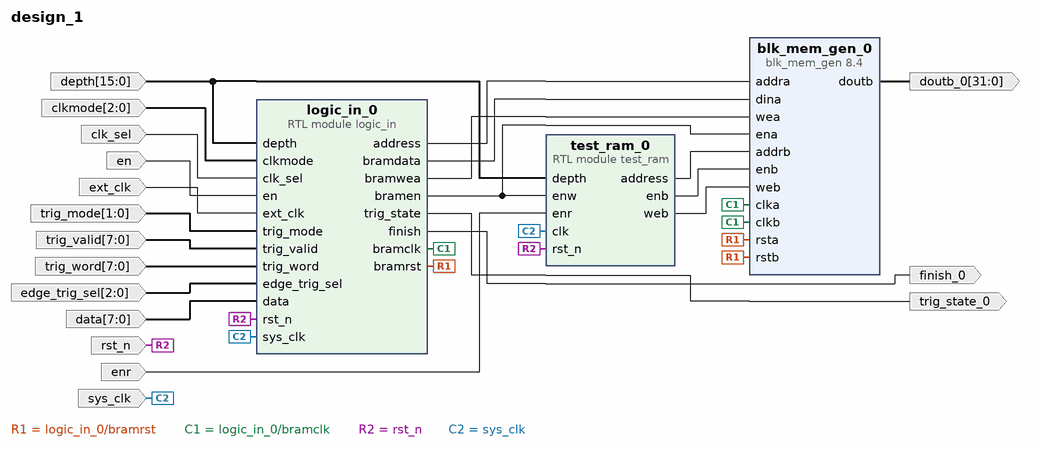
[diagram p0: block diagram of the top level]
# Vivado block design design_1, xc7z020clg400-1, Vivado 2018.3
create_bd_design design_1

create_bd_port -dir I -from 2 -to 0 clkmode
create_bd_port -dir I -from 15 -to 0 depth
create_bd_port -dir I -type rst rst_n
create_bd_port -dir I clk_sel
create_bd_port -dir I en
create_bd_port -dir I -type clk ext_clk
create_bd_port -dir I -type clk sys_clk
create_bd_port -dir O -from 31 -to 0 doutb_0
create_bd_port -dir I enr
create_bd_port -dir O trig_state_0
create_bd_port -dir I -from 1 -to 0 trig_mode
create_bd_port -dir I -from 7 -to 0 trig_valid
create_bd_port -dir I -from 7 -to 0 trig_word
create_bd_port -dir I -from 2 -to 0 edge_trig_sel
create_bd_port -dir I -from 7 -to 0 data
create_bd_port -dir O finish_0

create_bd_cell -type ip -vlnv xilinx.com:ip:blk_mem_gen:8.4 blk_mem_gen_0
set_property -dict [list \
  CONFIG.EN_SAFETY_CKT false \
  CONFIG.Enable_B Use_ENB_Pin \
  CONFIG.Memory_Type True_Dual_Port_RAM \
  CONFIG.Port_B_Clock 100 \
  CONFIG.Port_B_Enable_Rate 100 \
  CONFIG.Port_B_Write_Rate 50 \
  CONFIG.Use_RSTB_Pin true \
] [get_bd_cells blk_mem_gen_0]
create_bd_cell -type module -reference test_ram test_ram_0
create_bd_cell -type module -reference logic_in logic_in_0

# ---- connections ----

connect_bd_net [get_bd_pins logic_in_0/address] [get_bd_pins blk_mem_gen_0/addra]
connect_bd_net [get_bd_pins logic_in_0/bramdata] [get_bd_pins blk_mem_gen_0/dina]
connect_bd_net [get_bd_pins logic_in_0/bramen] [get_bd_pins blk_mem_gen_0/ena] [get_bd_pins test_ram_0/enw]
connect_bd_net [get_bd_pins logic_in_0/bramwea] [get_bd_pins blk_mem_gen_0/wea]
connect_bd_net [get_bd_pins logic_in_0/bramrst] [get_bd_pins blk_mem_gen_0/rsta] [get_bd_pins blk_mem_gen_0/rstb]
connect_bd_net [get_bd_pins logic_in_0/bramclk] [get_bd_pins blk_mem_gen_0/clka] [get_bd_pins blk_mem_gen_0/clkb]
connect_bd_net -net clkmode_0_1 [get_bd_ports clkmode] [get_bd_pins logic_in_0/clkmode]
connect_bd_net -net depth_0_1 [get_bd_ports depth] [get_bd_pins test_ram_0/depth] [get_bd_pins logic_in_0/depth]
connect_bd_net [get_bd_ports rst_n] [get_bd_pins test_ram_0/rst_n] [get_bd_pins logic_in_0/rst_n]
connect_bd_net -net clk_sel_0_1 [get_bd_ports clk_sel] [get_bd_pins logic_in_0/clk_sel]
connect_bd_net -net en_0_1 [get_bd_ports en] [get_bd_pins logic_in_0/en]
connect_bd_net -net ext_clk_0_1 [get_bd_ports ext_clk] [get_bd_pins logic_in_0/ext_clk]
connect_bd_net -net sys_clk_0_1 [get_bd_ports sys_clk] [get_bd_pins test_ram_0/clk] [get_bd_pins logic_in_0/sys_clk]
connect_bd_net [get_bd_pins test_ram_0/address] [get_bd_pins blk_mem_gen_0/addrb]
connect_bd_net [get_bd_pins test_ram_0/enb] [get_bd_pins blk_mem_gen_0/enb]
connect_bd_net [get_bd_pins test_ram_0/web] [get_bd_pins blk_mem_gen_0/web]
connect_bd_net [get_bd_pins blk_mem_gen_0/doutb] [get_bd_ports doutb_0]
connect_bd_net -net enr_0_1 [get_bd_ports enr] [get_bd_pins test_ram_0/enr]
connect_bd_net [get_bd_pins logic_in_0/trig_state] [get_bd_ports trig_state_0]
connect_bd_net -net trig_mode_0_1 [get_bd_ports trig_mode] [get_bd_pins logic_in_0/trig_mode]
connect_bd_net -net trig_valid_0_1 [get_bd_ports trig_valid] [get_bd_pins logic_in_0/trig_valid]
connect_bd_net -net trig_word_0_1 [get_bd_ports trig_word] [get_bd_pins logic_in_0/trig_word]
connect_bd_net -net edge_trig_sel_0_1 [get_bd_ports edge_trig_sel] [get_bd_pins logic_in_0/edge_trig_sel]
connect_bd_net -net data_0_1 [get_bd_ports data] [get_bd_pins logic_in_0/data]
connect_bd_net [get_bd_pins logic_in_0/finish] [get_bd_ports finish_0]

validate_bd_design
save_bd_design
